# Altium schematic sheet MCU_board_2024-08-19.schdoc
size 187 x 110 mm
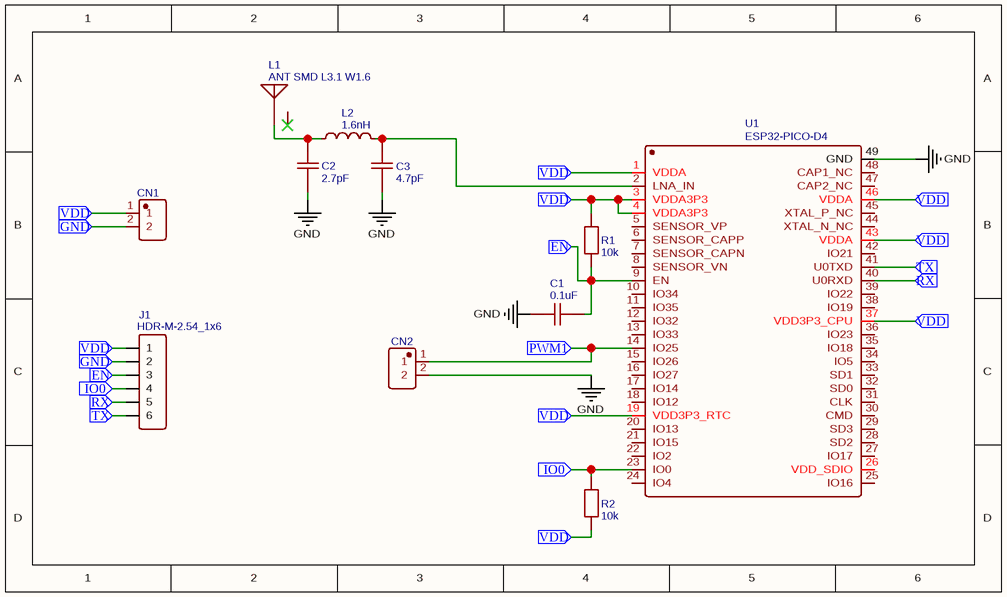
[diagram p0: MCU_board_2024-08-19.schdoc]

## Parts
C1  0.1uF  [C0402]
C2  2.7pF  [C0402]
C3  4.7pF  [C0402]
CN1  KH-1.27FH-1X2P-H4.3  [HDR-TH_2P-P1.27-V-F]  (value not drawn)
CN2  KH-1.27FH-1X2P-H4.3  [HDR-TH_2P-P1.27-V-F]  (value not drawn)
J1  HDR-M-2.54_1x6  [CONN-TH_6P-P1.27_KINGHELM_KH-1.27FH-1X6P-H4.3]
L1  ANT SMD L3.1 W1.6  [ANT-SMD_L3.1-W1.6]
L2  1.6nH  [L0402]
R1  10k  [R0402]
R2  10k  [R0402]
U1  ESP32-PICO-D4  [LGA-48_L7.0-W7.0-P0.50-BL-EP5.4]

## Ports
EN (in), GND (in), IO0 (in), PWM1 (in), RX (in), TX (in), VDD (in)

## Nets
GND: C1.2 C2.1 C3.1 CN2.2 U1.49(GND)
EN: C1.1 J1.3 R1.1 U1.9(EN) ; port EN
GND: CN1.2 J1.2 ; port GND  [a separate net that carries the same name]
IO0: J1.4 R2.2 U1.23(IO0) ; port IO0
PWM1: CN2.1 U1.14(IO25) ; port PWM1
RX: J1.5 U1.40(U0RXD) ; port RX
TX: J1.6 U1.41(U0TXD) ; port TX
VDD: CN1.1 J1.1 R1.2 R2.1 U1.1(VDDA) U1.3(VDDA3P3) U1.4(VDDA3P3) U1.19(VDD3P3_RTC) U1.37(VDD3P3_CPU) U1.43(VDDA) U1.46(VDDA) ; port VDD
NetC2_2: C2.2 L1.1(ANT) L2.1
NetC3_2: C3.2 L2.2 U1.2(LNA_IN)

Not connected (* = marked no-connect by the designer): L1 2*; U1 5(SENSOR_VP) 6(SENSOR_CAPP) 7(SENSOR_CAPN) 8(SENSOR_VN) 10(IO34) 11(IO35) 12(IO32) 13(IO33) 15(IO26) 16(IO27) 17(IO14) 18(IO12) 20(IO13) 21(IO15) 22(IO2) 24(IO4) 25(IO16) 26(VDD_SDIO) 27(IO17) 28(SD2) 29(SD3) 30(CMD) 31(CLK) 32(SD0) 33(SD1) 34(IO5) 35(IO18) 36(IO23) 38(IO19) 39(IO22) 42(IO21) 44(XTAL_N_NC) 45(XTAL_P_NC) 47(CAP2_NC) 48(CAP1_NC)

## Library data of the parts
C1 = 0.1uF: nameAlias: Value(F); Contributor: LCEDA_Lib; spicePre: C; spiceSymbolName: C_0201_US
C2 = 2.7pF: nameAlias: Value(F); Contributor: LCEDA_Lib; spicePre: C; spiceSymbolName: C_0201_US
C3 = 4.7pF: nameAlias: Value(F); Contributor: LCEDA_Lib; spicePre: C; spiceSymbolName: C_0201_US
CN1 CN2 = KH-1.27FH-1X2P-H4.3: Manufacturer: kinghelm(金航标); Contributor: LCSC; Supplier: LCSC; Supplier Part: C2938380; Manufacturer Part: KH-1.27FH-1X2P-H4.3; JLCPCB Part Class: Extended Part; spicePre: U; spiceSymbolName: KH-1.27FH-1X2P-H4.3
J1 = HDR-M-2.54_1x6: Contributor: LCEDA_Lib; Package Display: No; BOM_Supplier Part: C190819; BOM_Supplier: LCSC; spicePre: J; spiceSymbolName: HDR-M-2.54_1x6
L1 = ANT SMD L3.1 W1.6: Manufacturer: rainsun(霖昱微); Manufacturer Part: AN2051-245; Supplier: LCSC; Supplier Part: C99727; JLCPCB Part Class: Extended Part; spicePre: L; spiceSymbolName: AN2051-245
L2 = 1.6nH: nameAlias: Value(H); Contributor: LCEDA_Lib; spicePre: L; spiceSymbolName: L0603_US
R1 R2 = 10k: nameAlias: Value(Ω); Contributor: LCEDA_Lib; spicePre: R; spiceSymbolName: R_0603_EU
U1 = ESP32-PICO-D4: Manufacturer: ESPRESSIF(乐鑫); Contributor: LCSC; nameAlias: Value; Supplier: LCSC; Supplier Part: C193707; Manufacturer Part: ESP32-PICO-D4; JLCPCB Part Class: Extended Part; spicePre: U; spiceSymbolName: ESP32-PICO-D4